# EAGLE design matrix (EAGLE 9.1.3)
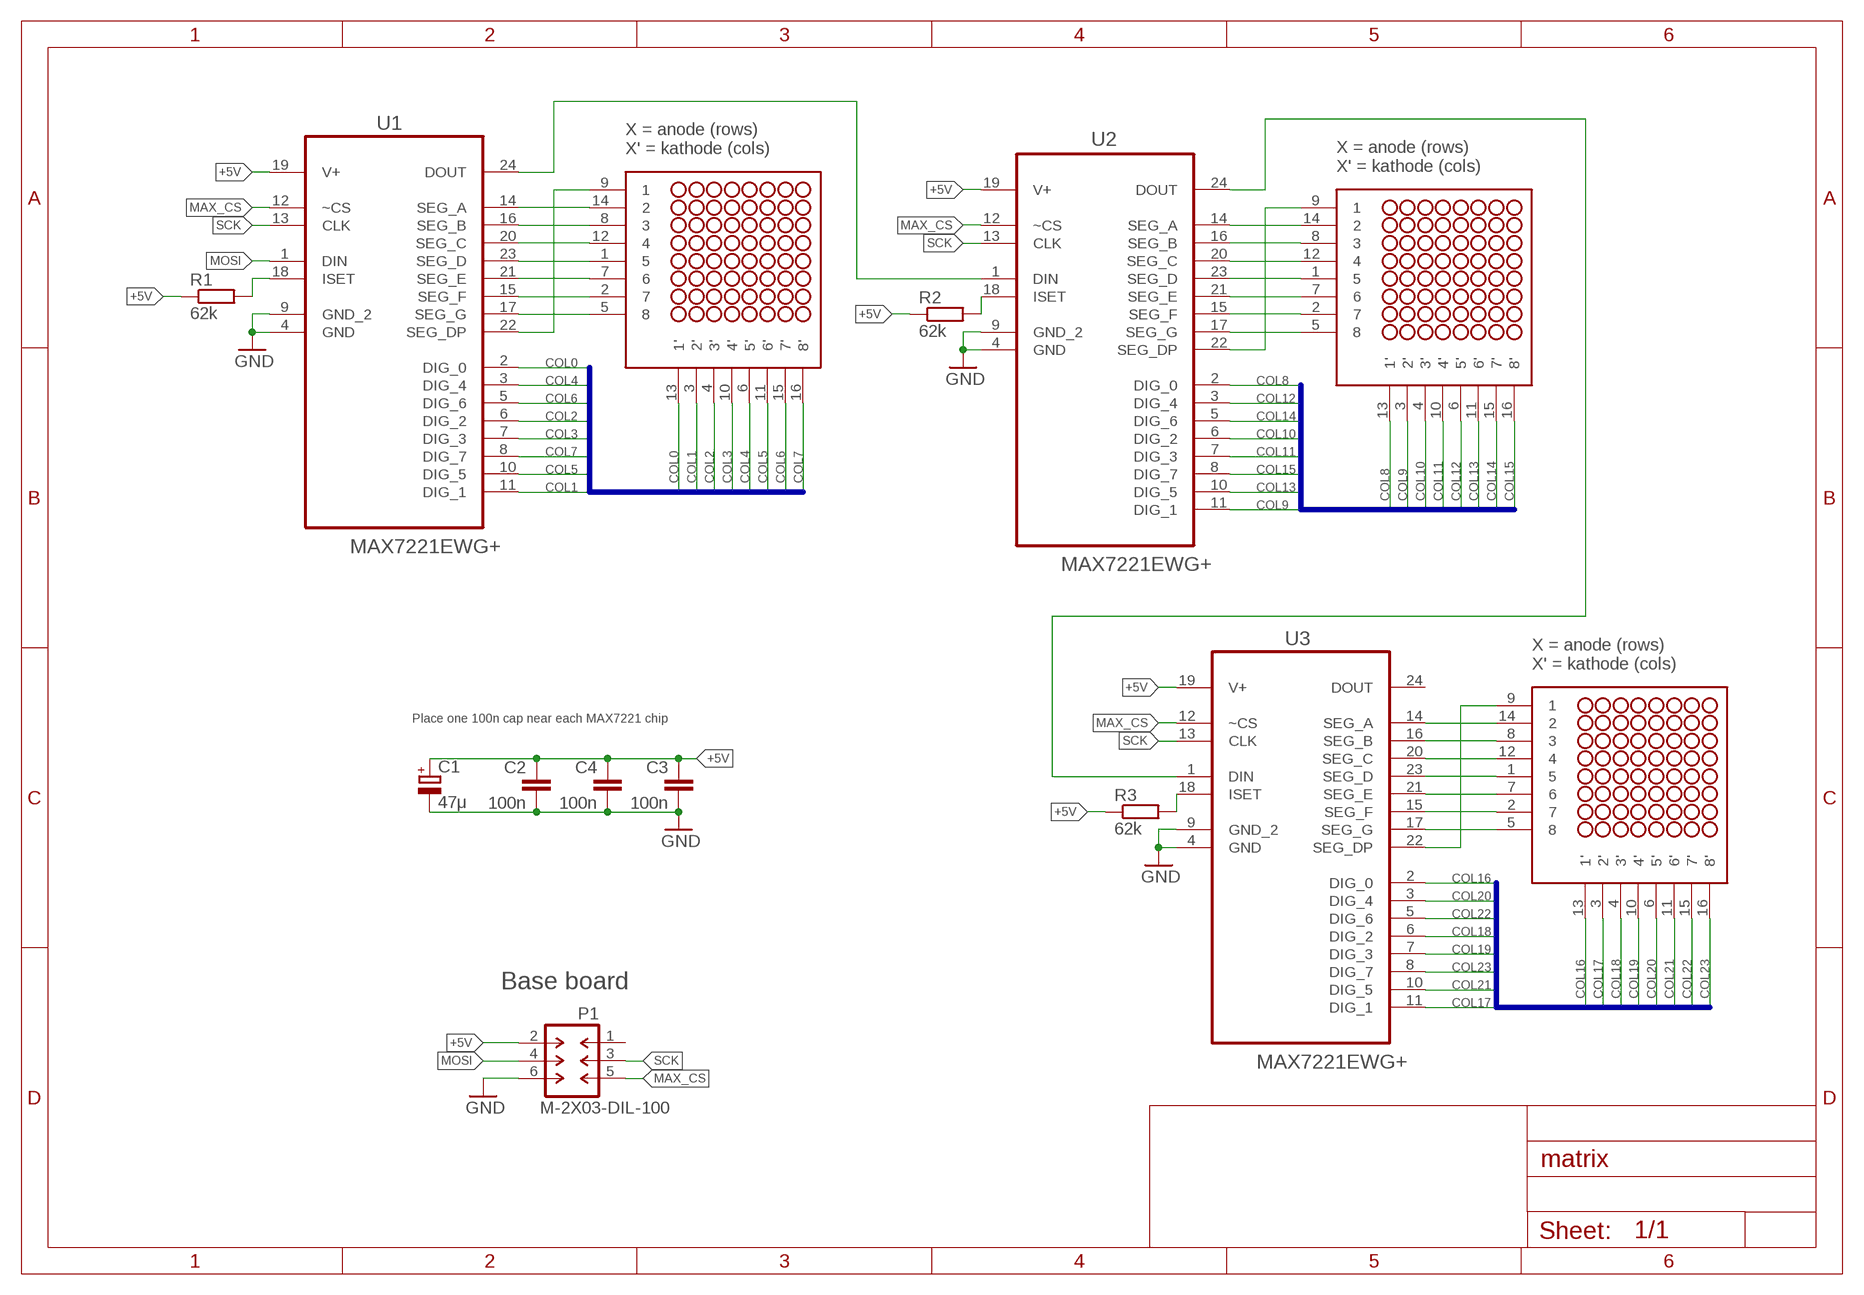
[diagram p0: schematic, sheet 1]

## Parts
C1  47μ  CPOL-EUD/7343-31W  [D/7343-31W]
C2  100n  C-EUC1206  [C1206]
C3  100n  C-EUC1206  [C1206]
C4  100n  C-EUC1206  [C1206]
M1  1088BS  NFM-12881BG-11  [NFM-12881BG-11]
M2  1088BS  NFM-12881BG-11  [NFM-12881BG-11]
M3  1088BS  NFM-12881BG-11  [NFM-12881BG-11]
P1  M-2X03-DIL-100  [DIL-100-2X03]
R1  62k  R-EU_R1206  [R1206]
R2  62k  R-EU_R1206  [R1206]
R3  62k  R-EU_R1206  [R1206]
U1  MAX7221EWG+  [SOIC127P1032X265-24N]
U2  MAX7221EWG+  [SOIC127P1032X265-24N]
U3  MAX7221EWG+  [SOIC127P1032X265-24N]

## Nets
+5V: C1.+ C2.1 C3.1 C4.1 P1.2 R1.1 R2.1 R3.1 U1.19(V+) U2.19(V+) U3.19(V+)
COL0: M1.13(1') U1.2(DIG_0)
COL1: M1.3(2') U1.11(DIG_1)
COL2: M1.4(3') U1.6(DIG_2)
COL3: M1.10(4') U1.7(DIG_3)
COL4: M1.6(5') U1.3(DIG_4)
COL5: M1.11(6') U1.10(DIG_5)
COL6: M1.15(7') U1.5(DIG_6)
COL7: M1.16(8') U1.8(DIG_7)
COL8: M2.13(1') U2.2(DIG_0)
COL9: M2.3(2') U2.11(DIG_1)
COL10: M2.4(3') U2.6(DIG_2)
COL11: M2.10(4') U2.7(DIG_3)
COL12: M2.6(5') U2.3(DIG_4)
COL13: M2.11(6') U2.10(DIG_5)
COL14: M2.15(7') U2.5(DIG_6)
COL15: M2.16(8') U2.8(DIG_7)
COL16: M3.13(1') U3.2(DIG_0)
COL17: M3.3(2') U3.11(DIG_1)
COL18: M3.4(3') U3.6(DIG_2)
COL19: M3.10(4') U3.7(DIG_3)
COL20: M3.6(5') U3.3(DIG_4)
COL21: M3.11(6') U3.10(DIG_5)
COL22: M3.15(7') U3.5(DIG_6)
COL23: M3.16(8') U3.8(DIG_7)
GND: C1.- C2.2 C3.2 C4.2 P1.6 U1.4(GND) U1.9(GND_2) U2.4(GND) U2.9(GND_2) U3.4(GND) U3.9(GND_2)
MAX_CS: P1.5 U1.12(~CS) U2.12(~CS) U3.12(~CS)
MOSI: P1.4 U1.1(DIN)
N$1: M1.9 U1.22(SEG_DP)
N$2: M1.5 U1.17(SEG_G)
N$3: M1.2 U1.15(SEG_F)
N$4: M1.7 U1.21(SEG_E)
N$5: M1.1 U1.23(SEG_D)
N$6: M1.12 U1.20(SEG_C)
N$7: M1.8 U1.16(SEG_B)
N$8: M1.14 U1.14(SEG_A)
N$9: M2.9 U2.22(SEG_DP)
N$10: M2.14 U2.14(SEG_A)
N$11: M2.8 U2.16(SEG_B)
N$12: M2.12 U2.20(SEG_C)
N$13: M2.1 U2.23(SEG_D)
N$14: M2.7 U2.21(SEG_E)
N$15: M2.2 U2.15(SEG_F)
N$16: M2.5 U2.17(SEG_G)
N$17: M3.9 U3.22(SEG_DP)
N$18: M3.5 U3.17(SEG_G)
N$19: M3.2 U3.15(SEG_F)
N$20: M3.7 U3.21(SEG_E)
N$21: M3.1 U3.23(SEG_D)
N$22: M3.12 U3.20(SEG_C)
N$23: M3.8 U3.16(SEG_B)
N$24: M3.14 U3.14(SEG_A)
N$25: U1.24(DOUT) U2.1(DIN)
N$26: U2.24(DOUT) U3.1(DIN)
N$29: R1.2 U1.18(ISET)
N$30: R2.2 U2.18(ISET)
N$31: R3.2 U3.18(ISET)
SCK: P1.3 U1.13(CLK) U2.13(CLK) U3.13(CLK)
Unconnected: P1.1 U3.24(DOUT)

## Buses
COL[0..23]

## Notes on the sheet
- X = anode (rows)
  X' = kathode (cols)
- X = anode (rows)
  X' = kathode (cols)
- X = anode (rows)
  X' = kathode (cols)
- Place one 100n cap near each MAX7221 chip
- Base board

## Library data of the parts
C1 = rcl:CPOL-EU: POLARIZED CAPACITOR, European symbol
C2-C4 = rcl:C-EU: CAPACITOR, European symbol
M1-M3 = display8x8:NFM-12881BG-11: Futurlec 8x8 LED Matrix
P1 = con-headers-jp:M-2X03-: MALE HEADER
R1-R3 = rcl:R-EU_: RESISTOR, European symbol
U1-U3 = Maxim_By_element14_Batch_1:MAX7221EWG+: Serially Interfaced, 8-Digit LED Display Drivers; MPN: MAX7221EWG+; OC_FARNELL: -; OC_NEWARK: 68K5011; PACKAGE: SOIC-24; SUPPLIER: Maxim

## Board
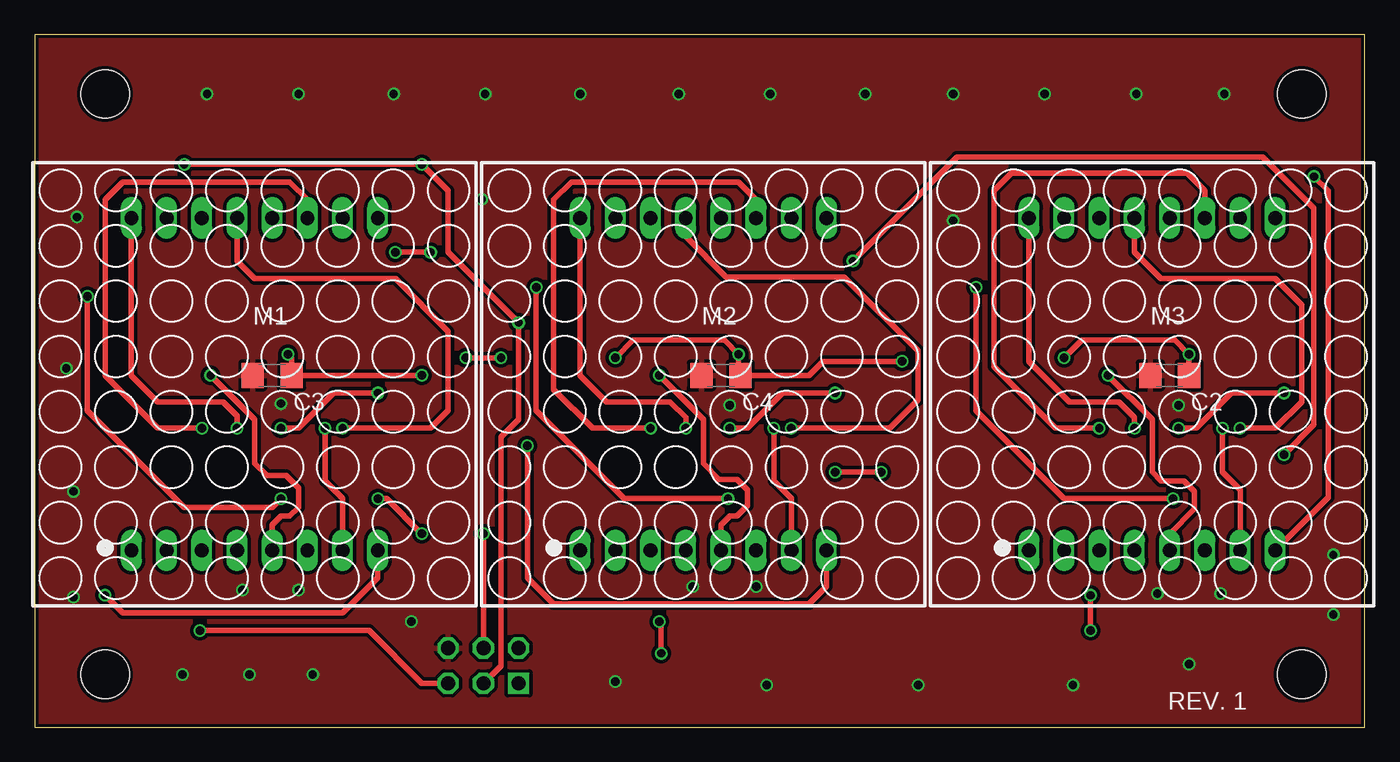
[diagram p1: board, top side]
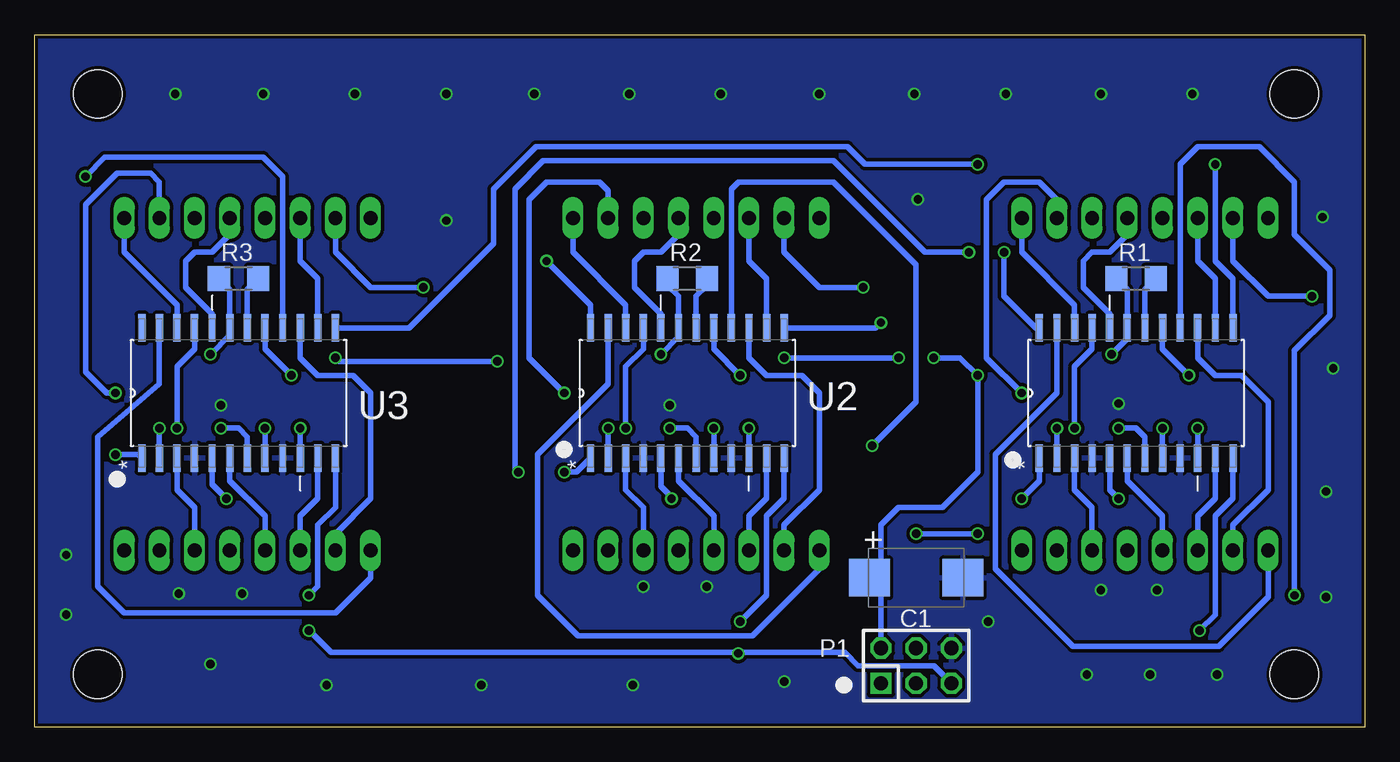
[diagram p2: board, bottom side, seen from below]

Size 96 x 50 mm. Coordinates in mm from the lower left corner, seen from the top.
Outline: 0,0 96,0 96,50 0,50 0,0
Copper layers (1*16): Top 0.035mm / dielectric 0.2mm / Bottom 0.035mm
Design rules "seeedstudio *": minimum track width 6mil, minimum drill 12mil, track to track 6mil, track to pad 6mil, pad to pad 6mil, via to via 6mil, smd to smd 0mil, copper to edge 10mil, drill to drill 10mil, minimum pad ring 6mil, minimum via ring 6mil, stop-mask expansion 2mil, vias tented up to drill 25mil, thermal gap 10mil
Holes 3.5 mm at 5.08,3.81 5.08,45.72 91.44,45.72 91.44,3.81

### Footprints (pad centres in the part's own frame; a part is rotated, then mirrored left to right if it is on the bottom)
D/7343-31W = smd 2.95 x 2.7: + 3.375,0; - -3.375,0
C1206 = smd 1.6 x 1.8: 1 -1.4,0; 2 1.4,0
NFM-12881BG-11 = drill 1 long: 1 -8.89,-12; 2 -6.35,-12; 3 -3.81,-12; 4 -1.27,-12; 5 1.27,-12; 6 3.81,-12; 7 6.35,-12; 8 8.89,-12; 9 8.89,12; 10 6.35,12; 11 3.81,12; 12 1.27,12; 13 -1.27,12; 14 -3.81,12; 15 -6.35,12; 16 -8.89,12
DIL-100-2X03 = drill 1.016 square: 1 -2.54,-1.27 | drill 1.016 octagon: 2 -2.54,1.27; 3 0,-1.27; 4 0,1.27; 5 2.54,-1.27; 6 2.54,1.27
R1206 = smd 1.6 x 1.803: 1 -1.422,0; 2 1.422,0
SOIC127P1032X265-24N = smd 1.981 x 0.533: 1 -4.699,6.985; 2 -4.699,5.715; 3 -4.699,4.445; 4 -4.699,3.175; 5 -4.699,1.905; 6 -4.699,0.635; 7 -4.699,-0.635; 8 -4.699,-1.905; 9 -4.699,-3.175; 10 -4.699,-4.445; 11 -4.699,-5.715; 12 -4.699,-6.985; 13 4.699,-6.985; 14 4.699,-5.715; 15 4.699,-4.445; 16 4.699,-3.175; 17 4.699,-1.905; 18 4.699,-0.635; 19 4.699,0.635; 20 4.699,1.905; 21 4.699,3.175; 22 4.699,4.445; 23 4.699,5.715; 24 4.699,6.985

### Placement (x,y rotation side)
C1  32.38,10.79 180 bottom
C2  81.92,25.4 180 top
C3  17.14,25.4 180 top
C4  49.53,25.4 180 top
M1  15.88,24.77 0 top
M2  48.26,24.77 0 top
M3  80.64,24.77 0 top
P1  32.38,4.45 0 bottom
R1  16.51,32.38 0 bottom
R2  48.9,32.38 0 bottom
R3  81.28,32.38 0 bottom
U1  16.51,24.13 90 bottom
U2  48.9,24.13 90 bottom
U3  81.28,24.13 90 bottom

### Tracks (layer width: path | path; a pad name or v marks a point on that pad's centre or on a via)
+5V  (via drill 0.6)
  Top 0.406: v27.94,25.4 C3.1 18.55,26.67 v18.29,26.92 | C2.1 v83.31,26.92 82.3,27.94 75.56,27.94 v74.3,26.67 | v41.91,26.67 43.18,27.94 49.78,27.94 v50.8,26.92 50.8,25.53 C4.1 55.88,25.4 56.9,26.42 v62.61,26.42 | v33.66,26.67 v31.11,26.67
  Bottom 0.406: v18.29,26.92 17.14,28.07 U1.19 17.14,31.6 R1.1 | R2.1 50.32,31.9 49.53,31.11 U2.19 49.53,28.19 v50.8,26.92 | R3.1 81.92,31.6 U3.19 81.92,28.32 v83.31,26.92 | v41.91,26.67 v33.66,26.67 | v31.11,26.67 29.21,26.67 v27.94,25.4 27.94,18.41 30.48,15.88 33.66,15.88 34.92,14.61 34.92,10.79 | v62.61,26.42 74.04,26.42 v74.3,26.67 | C1.+ 34.92,10.79 | 34.92,10.79 P1.2
COL0  (via drill 0.6)
  Top 0.406: v22.23,21.59 28.57,21.59 29.84,22.86 29.84,28.57 26.04,32.38 15.88,32.38 14.61,33.66 M1.13
  Bottom 0.406: U1.2 v22.23,21.59
COL1
  Bottom 0.406: M1.3 12.06,15.24 10.79,16.51 U1.11
COL2
  Bottom 0.406: U1.6 17.14,17.78 14.61,15.24 M1.4
COL3  (via drill 0.6)
  Top 0.406: v17.78,21.59 19.05,21.59 21.59,24.13 v24.77,24.13
  Bottom 0.406: U1.7 15.88,20.95 16.51,21.59 v17.78,21.59 | v24.77,24.13 27.3,26.67 27.3,38.1 26.04,39.37 23.5,39.37 22.23,38.1 M1.10
COL4
  Bottom 0.406: U1.3 20.95,17.14 19.68,15.88 M1.6
COL5  (via drill 0.6)
  Top 0.406: v12.06,21.59 8.89,21.59 5.08,25.4 5.08,38.1 6.35,39.37 18.41,39.37 19.68,38.1 M1.11
  Bottom 0.406: U1.10 v12.06,21.59
COL6  (via drill 0.6)
  Top 0.406: v3.81,31.11 3.81,22.86 10.79,15.88 17.14,15.88 v17.78,16.51
  Bottom 0.406: v3.81,31.11 6.99,31.11 9.53,33.66 M1.15 | U1.5 18.41,18.16 18.41,17.14 v17.78,16.51
COL7  (via drill 0.6)
  Top 0.406: M1.16 6.99,25.4 8.89,23.5 13.59,23.5 14.61,22.48 v14.61,21.59
  Bottom 0.406: U1.8 v14.61,21.59
COL8  (via drill 0.6)
  Top 0.406: v54.61,21.59 61.72,21.59 63.75,23.62 63.75,27.18 58.42,32.51 49.91,32.51 46.99,35.43 M2.13
  Bottom 0.406: U2.2 v54.61,21.59
COL9
  Bottom 0.406: U2.11 43.18,16.51 44.45,15.24 M2.3
COL10
  Bottom 0.406: M2.4 46.99,15.24 49.53,17.78 U2.6
COL11  (via drill 0.6)
  Top 0.406: v50.16,21.59 51.44,21.59 53.98,24.13 v57.78,24.13
  Bottom 0.406: U2.7 48.26,20.95 48.9,21.59 v50.16,21.59 | v57.78,24.13 60.33,26.67 60.33,38.1 59.05,39.37 55.24,39.37 54.61,38.73 M2.10
COL12
  Bottom 0.406: M2.6 52.07,15.88 53.34,17.14 U2.3
COL13  (via drill 0.6)
  Top 0.406: v44.45,21.59 40.26,21.59 37.47,24.38 37.47,38.1 38.73,39.37 50.8,39.37 52.07,38.1 M2.11
  Bottom 0.406: U2.10 v44.45,21.59
COL14  (via drill 0.6)
  Top 0.406: v50.04,16.51 42.55,16.51 36.2,22.86 v36.2,31.75
  Bottom 0.406: v50.04,16.51 50.04,16.64 50.8,17.4 U2.5 | v36.2,31.75 39.37,31.75 41.91,34.29 M2.15
COL15  (via drill 0.6)
  Top 0.406: M2.16 39.37,25.4 41.27,23.5 45.85,23.5 46.99,22.35 v46.99,21.59
  Bottom 0.406: U2.8 v46.99,21.59
COL16  (via drill 0.6)
  Top 0.406: v87,21.59 89.53,21.59 91.44,23.5 91.44,30.48 89.53,32.38 81.28,32.38 79.38,34.29 M3.13
  Bottom 0.406: U3.2 v87,21.59
COL17
  Bottom 0.406: M3.3 76.83,15.24 75.56,16.51 U3.11
COL18
  Bottom 0.406: M3.4 79.38,15.24 81.92,17.78 U3.6
COL19  (via drill 0.6)
  Top 0.406: v82.55,21.59 83.82,21.59 86.36,24.13 v90.17,24.13
  Bottom 0.406: U3.7 80.64,20.95 81.28,21.59 v82.55,21.59 | v90.17,24.13 90.81,24.13 92.33,25.65 92.33,37.72 90.04,40.01 87.63,40.01 87,39.37 M3.10
COL20
  Bottom 0.406: M3.6 84.45,15.88 85.72,17.14 U3.3
COL21  (via drill 0.6)
  Top 0.406: v76.83,21.59 73.66,21.59 69.22,26.04 69.22,38.73 70.48,40.01 83.19,40.01 84.45,38.73 M3.11
  Bottom 0.406: U3.10 v76.83,21.59
COL22  (via drill 0.6)
  Top 0.406: v67.94,31.75 67.94,22.86 74.3,16.51 v82.17,16.51
  Bottom 0.406: M3.15 74.3,34.29 71.75,31.75 v67.94,31.75 | U3.5 83.19,17.53 v82.17,16.51
COL23  (via drill 0.6)
  Top 0.406: M3.16 71.75,26.42 74.68,23.5 78.23,23.5 79.38,22.35 v79.38,21.59
  Bottom 0.406: U3.8 v79.38,21.59
GND  (via drill 0.6)
  other vias: 10.67,3.81 15.49,3.81 20.07,3.81 27.18,7.62 41.91,3.3 52.83,3.05 63.75,3.05 74.93,3.05 83.31,4.57 93.73,8.13 93.73,12.45 81.03,9.65 85.6,9.65 47.5,10.16 52.07,10.16 14.99,9.91 19.05,9.91 2.79,9.4 2.79,17.02 2.29,25.91 3.05,36.83 12.45,45.72 19.05,45.72 25.91,45.72 32.51,45.72 39.37,45.72 46.48,45.72 53.09,45.72 59.94,45.72 66.29,45.72 72.9,45.72 79.5,45.72 85.85,45.72 66.29,36.58 32.26,38.1 50.16,23.24 17.78,23.37 82.55,23.24
  pour Bottom (isolate 0.254): 0.25,50.04 96.01,50.04 96.01,0 0.25,0
  pour Top (isolate 0.254): 0.25,50.04 96.01,50.04 96.01,0 0.25,0
MAX_CS  (via drill 0.6)
  Top 0.406: P1.5 27.94,3.17 24.13,6.99 v11.94,6.99 | v45.21,5.33 45.21,7.49 v45.09,7.62 | v76.2,9.53 v76.2,6.99
  Bottom 0.406: U1.12 9.53,16.51 10.79,15.24 10.79,8.13 v11.94,6.99 | U2.12 41.91,16.51 43.18,15.24 43.18,9.53 v45.09,7.62 | U3.12 74.3,15.88 75.56,14.61 75.56,10.16 v76.2,9.53 | v76.2,6.99 74.61,5.4 45.21,5.4 | P1.5 31.11,4.45 36.58,4.45 37.53,5.4 45.21,5.4 | 45.21,5.4 v45.21,5.33
MOSI  (via drill 0.6)
  Top 0.406: P1.4 v32.38,13.97 | v27.94,13.97 25.4,16.51 v24.77,16.51
  Bottom 0.406: U1.1 23.5,17.78 v24.77,16.51 | v32.38,13.97 v27.94,13.97
N$1
  Bottom 0.406: U1.22 20.95,30.48 24.77,34.29 M1.9
N$2  (via drill 0.6)
  Top 0.406: v12.7,25.4 15.88,22.23 15.88,19.05 16.76,18.16 18.16,18.16 19.05,17.27 19.05,15.88 18.41,15.24 17.78,15.24 17.14,14.61 M1.5
  Bottom 0.406: U1.17 14.61,27.3 v12.7,25.4
N$3
  Bottom 0.406: U1.15 12.06,26.67 10.79,25.4 8.89,25.4 6.99,23.5 6.99,17.14 9.53,14.61 M1.2
N$4  (via drill 0.6)
  Top 0.406: v20.95,21.59 20.95,17.78 22.23,16.51 M1.7
  Bottom 0.406: v20.95,21.59 20.95,26.04 19.68,27.3 U1.21
N$5
  Bottom 0.406: U1.23 22.23,24.13 26.67,19.68 26.67,11.43 21.08,5.84 10.54,5.84 6.99,9.4 M1.1
N$6
  Bottom 0.406: U1.20 18.41,29.84 20.32,31.75 20.32,33.66 19.68,34.29 18.41,34.29 17.14,35.56 M1.12
N$7  (via drill 0.6)
  Top 0.406: M1.8 24.77,10.79 22.23,8.26 6.35,8.26 v5.08,9.53
  Bottom 0.406: U1.16 13.34,40.64 12.06,41.91 7.62,41.91 5.08,39.37 5.08,35.56 2.54,33.02 2.54,29.72 5.08,27.18 v5.08,9.53
N$8
  Bottom 0.406: U1.14 10.79,32.38 12.06,33.66 M1.14
N$9
  Bottom 0.406: U2.22 53.34,30.48 57.15,34.29 M2.9
N$10
  Bottom 0.406: M2.14 44.45,33.66 43.18,32.38 U2.14
N$11  (via drill 0.6)
  Top 0.406: M2.8 57.15,10.16 55.88,8.89 37.47,8.89 35.56,10.79 v35.56,20.32
  Bottom 0.406: U2.16 45.72,38.86 45.21,39.37 38.35,39.37 32.38,33.4 32.38,23.5 v35.56,20.32
N$12
  Bottom 0.406: U2.20 50.8,29.84 52.7,31.75 52.7,33.66 52.07,34.29 50.8,34.29 49.53,35.56 M2.12
N$13
  Bottom 0.406: U2.23 54.61,24.77 59.69,19.68 59.69,9.53 56.77,6.6 44.2,6.6 39.37,11.43 M2.1
N$14  (via drill 0.6)
  Top 0.406: v53.34,21.59 53.34,17.78 54.61,16.51 M2.7
  Bottom 0.406: U2.21 52.07,27.3 53.34,26.04 v53.34,21.59
N$15
  Bottom 0.406: U2.15 44.45,26.67 43.18,25.4 40.64,25.4 39.37,24.13 39.37,17.14 41.91,14.61 M2.2
N$16  (via drill 0.6)
  Top 0.406: v45.09,25.4 48.26,22.23 48.26,19.05 49.4,17.91 50.67,17.91 51.44,17.14 51.44,16 50.67,15.24 50.16,15.24 49.53,14.61 M2.5
  Bottom 0.406: U2.17 46.99,27.3 v45.09,25.4
N$17
  Bottom 0.406: M3.9 89.53,34.29 85.72,30.48 U3.22
N$18  (via drill 0.6)
  Top 0.406: v77.47,25.4 80.64,22.23 80.64,18.41 81.28,17.78 82.93,17.78 83.69,17.02 83.69,15.75 81.92,13.97 M3.5
  Bottom 0.406: U3.17 79.38,27.3 v77.47,25.4
N$19
  Bottom 0.406: U3.15 76.83,26.67 75.56,25.4 73.03,25.4 71.75,24.13 71.75,16.51 74.3,13.97 M3.2
N$20  (via drill 0.6)
  Top 0.406: M3.7 87,17.14 85.72,18.41 v85.72,21.59
  Bottom 0.406: v85.72,21.59 85.72,26.04 84.45,27.3 U3.21
N$21
  Bottom 0.406: M3.1 71.75,10.79 74.3,8.26 89.53,8.26 91.44,10.16 91.44,20.95 87,24.77 U3.23
N$22
  Bottom 0.406: U3.20 83.19,29.84 85.09,31.75 85.09,33.66 84.45,34.29 83.19,34.29 81.92,35.56 M3.12
N$23  (via drill 0.6)
  Top 0.406: v92.33,39.75 93.34,38.73 93.34,16.57 M3.8
  Bottom 0.406: U3.16 78.11,39.75 79.5,41.15 90.93,41.15 v92.33,39.75
N$24
  Bottom 0.406: M3.14 76.83,33.66 75.56,32.38 U3.14
N$25  (via drill 0.6)
  Top 0.406: v26.04,34.29 v28.57,34.29 | v61.09,18.41 v57.78,18.41
  Bottom 0.406: v61.09,18.41 61.34,18.67 61.34,38.86 59.31,40.89 38.35,40.89 31.75,34.29 v28.57,34.29 | v57.78,18.41 56.9,18.41 U2.1 | U1.24 23.75,28.83 26.04,31.11 v26.04,34.29
N$26  (via drill 0.6)
  Top 0.406: v59.05,33.66 66.55,41.15 88.65,41.15 92.33,37.47 92.33,21.84 v90.17,19.68
  Bottom 0.406: U2.24 55.88,30.48 v59.05,33.66 | v90.17,19.68 88.52,19.68 U3.1
N$29
  Bottom 0.406: U1.18 15.88,31.6 R1.2
N$30
  Bottom 0.406: R2.2 47.47,31.9 48.26,31.11 U2.18
N$31
  Bottom 0.406: U3.18 80.64,31.6 R3.2
SCK  (via drill 0.6)
  Top 0.406: v10.79,40.64 v27.94,40.64 29.84,38.73 29.84,34.29 v34.92,29.21 34.92,22.23 33.66,20.95 33.66,4.45 P1.3
  Bottom 0.406: U1.13 9.53,32.38 10.79,33.66 v10.79,40.64 | U2.13 35.31,28.83 v34.92,29.21 | U3.13 68.96,28.83 62.87,34.92 62.87,38.86 59.82,41.91 37.34,41.91 36.07,40.64 v27.94,40.64

### Text on the board
tNames: REV. 1
bNames: +